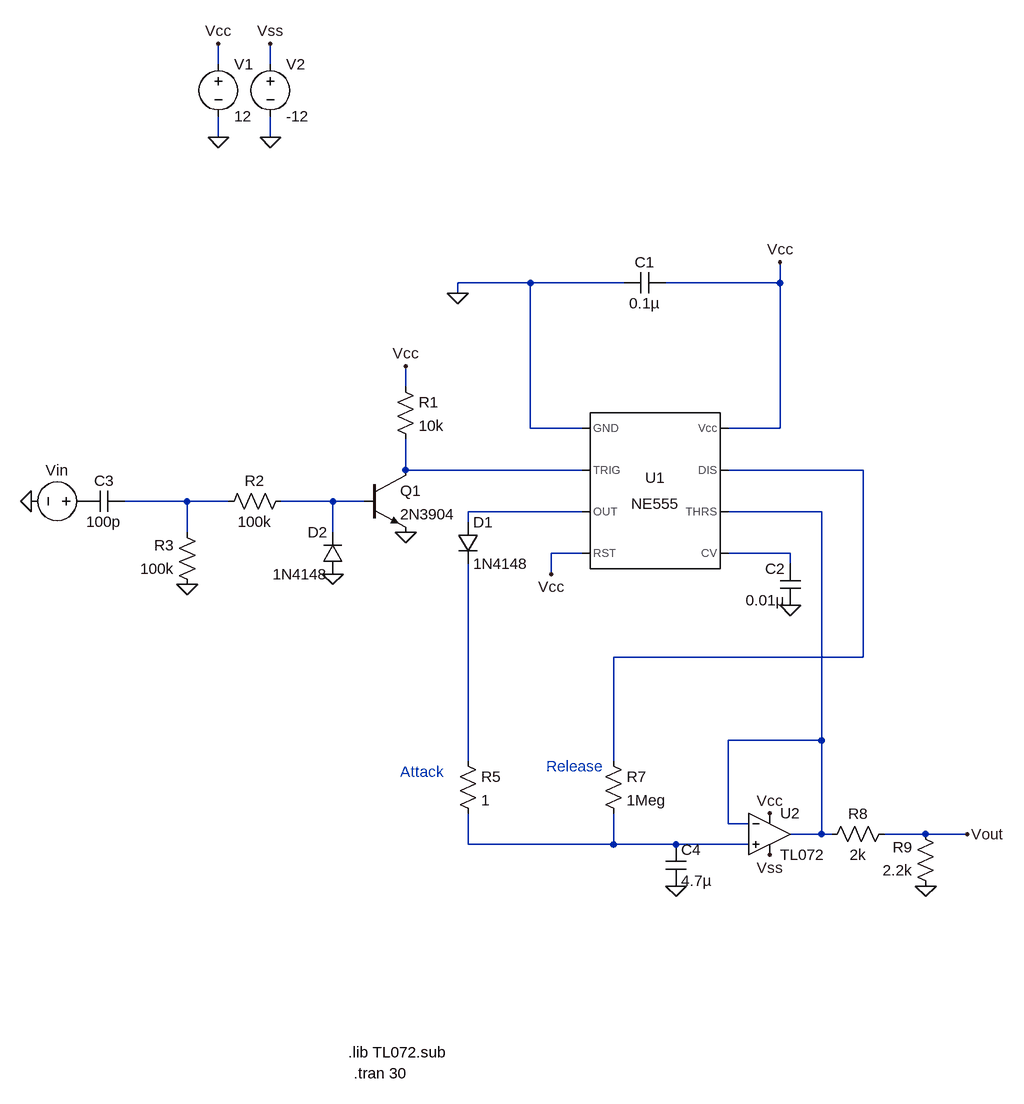
[diagram p0: schematic adsr.asc]
adsr.asc, the LTspice schematic file:
Version 4
SHEET 1 880 976
WIRE -432 -592 -432 -624
WIRE -352 -592 -352 -624
WIRE -432 -480 -432 -512
WIRE -352 -480 -352 -512
WIRE 48 -256 -64 -256
WIRE 192 -256 48 -256
WIRE 432 -256 432 -288
WIRE 432 -256 256 -256
WIRE -64 -240 -64 -256
WIRE -144 -96 -144 -128
WIRE 48 -32 48 -256
WIRE 128 -32 48 -32
WIRE 432 -32 432 -256
WIRE 432 -32 352 -32
WIRE -144 32 -144 -16
WIRE 128 32 -144 32
WIRE 560 32 352 32
WIRE -480 80 -576 80
WIRE -416 80 -480 80
WIRE -256 80 -336 80
WIRE -208 80 -256 80
WIRE 128 96 -48 96
WIRE 496 96 352 96
WIRE -48 112 -48 96
WIRE -480 128 -480 80
WIRE -256 128 -256 80
WIRE 128 160 80 160
WIRE 448 160 352 160
WIRE 448 176 448 160
WIRE 80 192 80 160
WIRE 560 320 560 32
WIRE 560 320 176 320
WIRE 496 448 496 96
WIRE 496 448 352 448
WIRE -48 480 -48 176
WIRE 176 480 176 320
WIRE 352 576 352 448
WIRE 384 576 352 576
WIRE 496 592 496 448
WIRE 496 592 448 592
WIRE 512 592 496 592
WIRE 656 592 592 592
WIRE 720 592 656 592
WIRE -48 608 -48 560
WIRE 176 608 176 560
WIRE 176 608 -48 608
WIRE 272 608 176 608
WIRE 384 608 272 608
FLAG -64 -240 0
FLAG 448 240 0
FLAG -480 208 0
FLAG -256 192 0
FLAG -432 -480 0
FLAG -352 -480 0
FLAG -432 -624 Vcc
FLAG -352 -624 Vss
FLAG -144 -128 Vcc
FLAG 432 -288 Vcc
FLAG 80 192 Vcc
FLAG 416 624 Vss
FLAG 416 560 Vcc
FLAG 656 672 0
FLAG 272 672 0
FLAG 720 592 Vout
FLAG -144 128 0
FLAG -720 80 0
SYMBOL Misc\\NE555 240 64 R0
SYMATTR InstName U1
SYMBOL cap 256 -272 R90
WINDOW 0 0 32 VBottom 2
WINDOW 3 32 32 VTop 2
SYMATTR InstName C1
SYMATTR Value 0.1µ
SYMBOL cap 464 240 R180
WINDOW 0 24 56 Left 2
WINDOW 3 24 8 Left 2
SYMATTR InstName C2
SYMATTR Value 0.01µ
SYMBOL diode -64 112 R0
SYMATTR InstName D1
SYMATTR Value 1N4148
SYMBOL npn -208 32 R0
SYMATTR InstName Q1
SYMATTR Value 2N3904
SYMBOL res -160 -112 R0
SYMATTR InstName R1
SYMATTR Value 10k
SYMBOL res -320 64 R90
WINDOW 0 0 56 VBottom 2
WINDOW 3 32 56 VTop 2
SYMATTR InstName R2
SYMATTR Value 100k
SYMBOL res -464 224 R180
WINDOW 0 36 76 Left 2
WINDOW 3 36 40 Left 2
SYMATTR InstName R3
SYMATTR Value 100k
SYMBOL cap -576 64 R90
WINDOW 0 0 32 VBottom 2
WINDOW 3 32 32 VTop 2
SYMATTR InstName C3
SYMATTR Value 100p
SYMBOL diode -240 192 R180
WINDOW 0 24 64 Left 2
WINDOW 3 24 0 Left 2
SYMATTR InstName D2
SYMATTR Value 1N4148
SYMBOL voltage -432 -608 R0
WINDOW 123 0 0 Left 0
WINDOW 39 0 0 Left 0
SYMATTR InstName V1
SYMATTR Value 12
SYMBOL voltage -352 -608 R0
WINDOW 123 0 0 Left 0
WINDOW 39 0 0 Left 0
SYMATTR InstName V2
SYMATTR Value -12
SYMBOL res -64 464 R0
SYMATTR InstName R5
SYMATTR Value 1
SYMBOL res 160 464 R0
SYMATTR InstName R7
SYMATTR Value 1Meg
SYMBOL cap 256 608 R0
SYMATTR InstName C4
SYMATTR Value 4.7µ
SYMBOL TL072 416 528 R0
SYMATTR InstName U2
SYMBOL res 608 576 R90
WINDOW 0 0 56 VBottom 2
WINDOW 3 32 56 VTop 2
SYMATTR InstName R8
SYMATTR Value 2k
SYMBOL res 672 688 R180
WINDOW 0 36 76 Left 2
WINDOW 3 36 40 Left 2
SYMATTR InstName R9
SYMATTR Value 2.2k
SYMBOL voltage -624 80 R90
WINDOW 0 -32 56 VBottom 2
WINDOW 3 32 56 Invisible 2
WINDOW 123 0 0 Left 0
WINDOW 39 0 0 Left 0
SYMATTR InstName Vin
SYMATTR Value PULSE(0 5 500m 1n 1n 10m 30)
TEXT -232 928 Left 2 !.lib TL072.sub
TEXT -224 960 Left 2 !.tran 30
TEXT -152 496 Left 2 ;Attack
TEXT 72 488 Left 2 ;Release

The netlist it stands for:
* adsr.asc
XU1 0 N001 N005 Vcc N007 N006 N002 Vcc NE555  ; pins GND TRIG OUT RST CV THRS DIS Vcc
C1 Vcc 0 0.1µ
C2 0 N007 0.01µ
D1 N005 N008 1N4148
Q1 N001 N004 0 0 2N3904
R1 Vcc N001 10k
R2 N004 N003 100k
R3 0 N003 100k
C3 N003 P001 100p
D2 0 N004 1N4148
V1 Vcc 0 12
V2 Vss 0 -12
R5 N008 N009 1
R7 N002 N009 1Meg
C4 N009 0 4.7µ
* U2: TL072 (symbol TL072 not available, pins judged from their places): In+=N009 In-=N006 V+=Vcc V-=Vss OUT=N006
R8 Vout N006 2k
R9 0 Vout 2.2k
Vin P001 0 PULSE(0 5 500m 1n 1n 10m 30)
.model D D
.lib standard.dio
.model NPN NPN
.model PNP PNP
.lib standard.bjt
.lib TL072.sub
.tran 30
* Attack
* Release
.lib NE555.sub
.backanno
.end